# EasyEDA Pro project I2S_XLR_Adapter.eprj, board PCB1
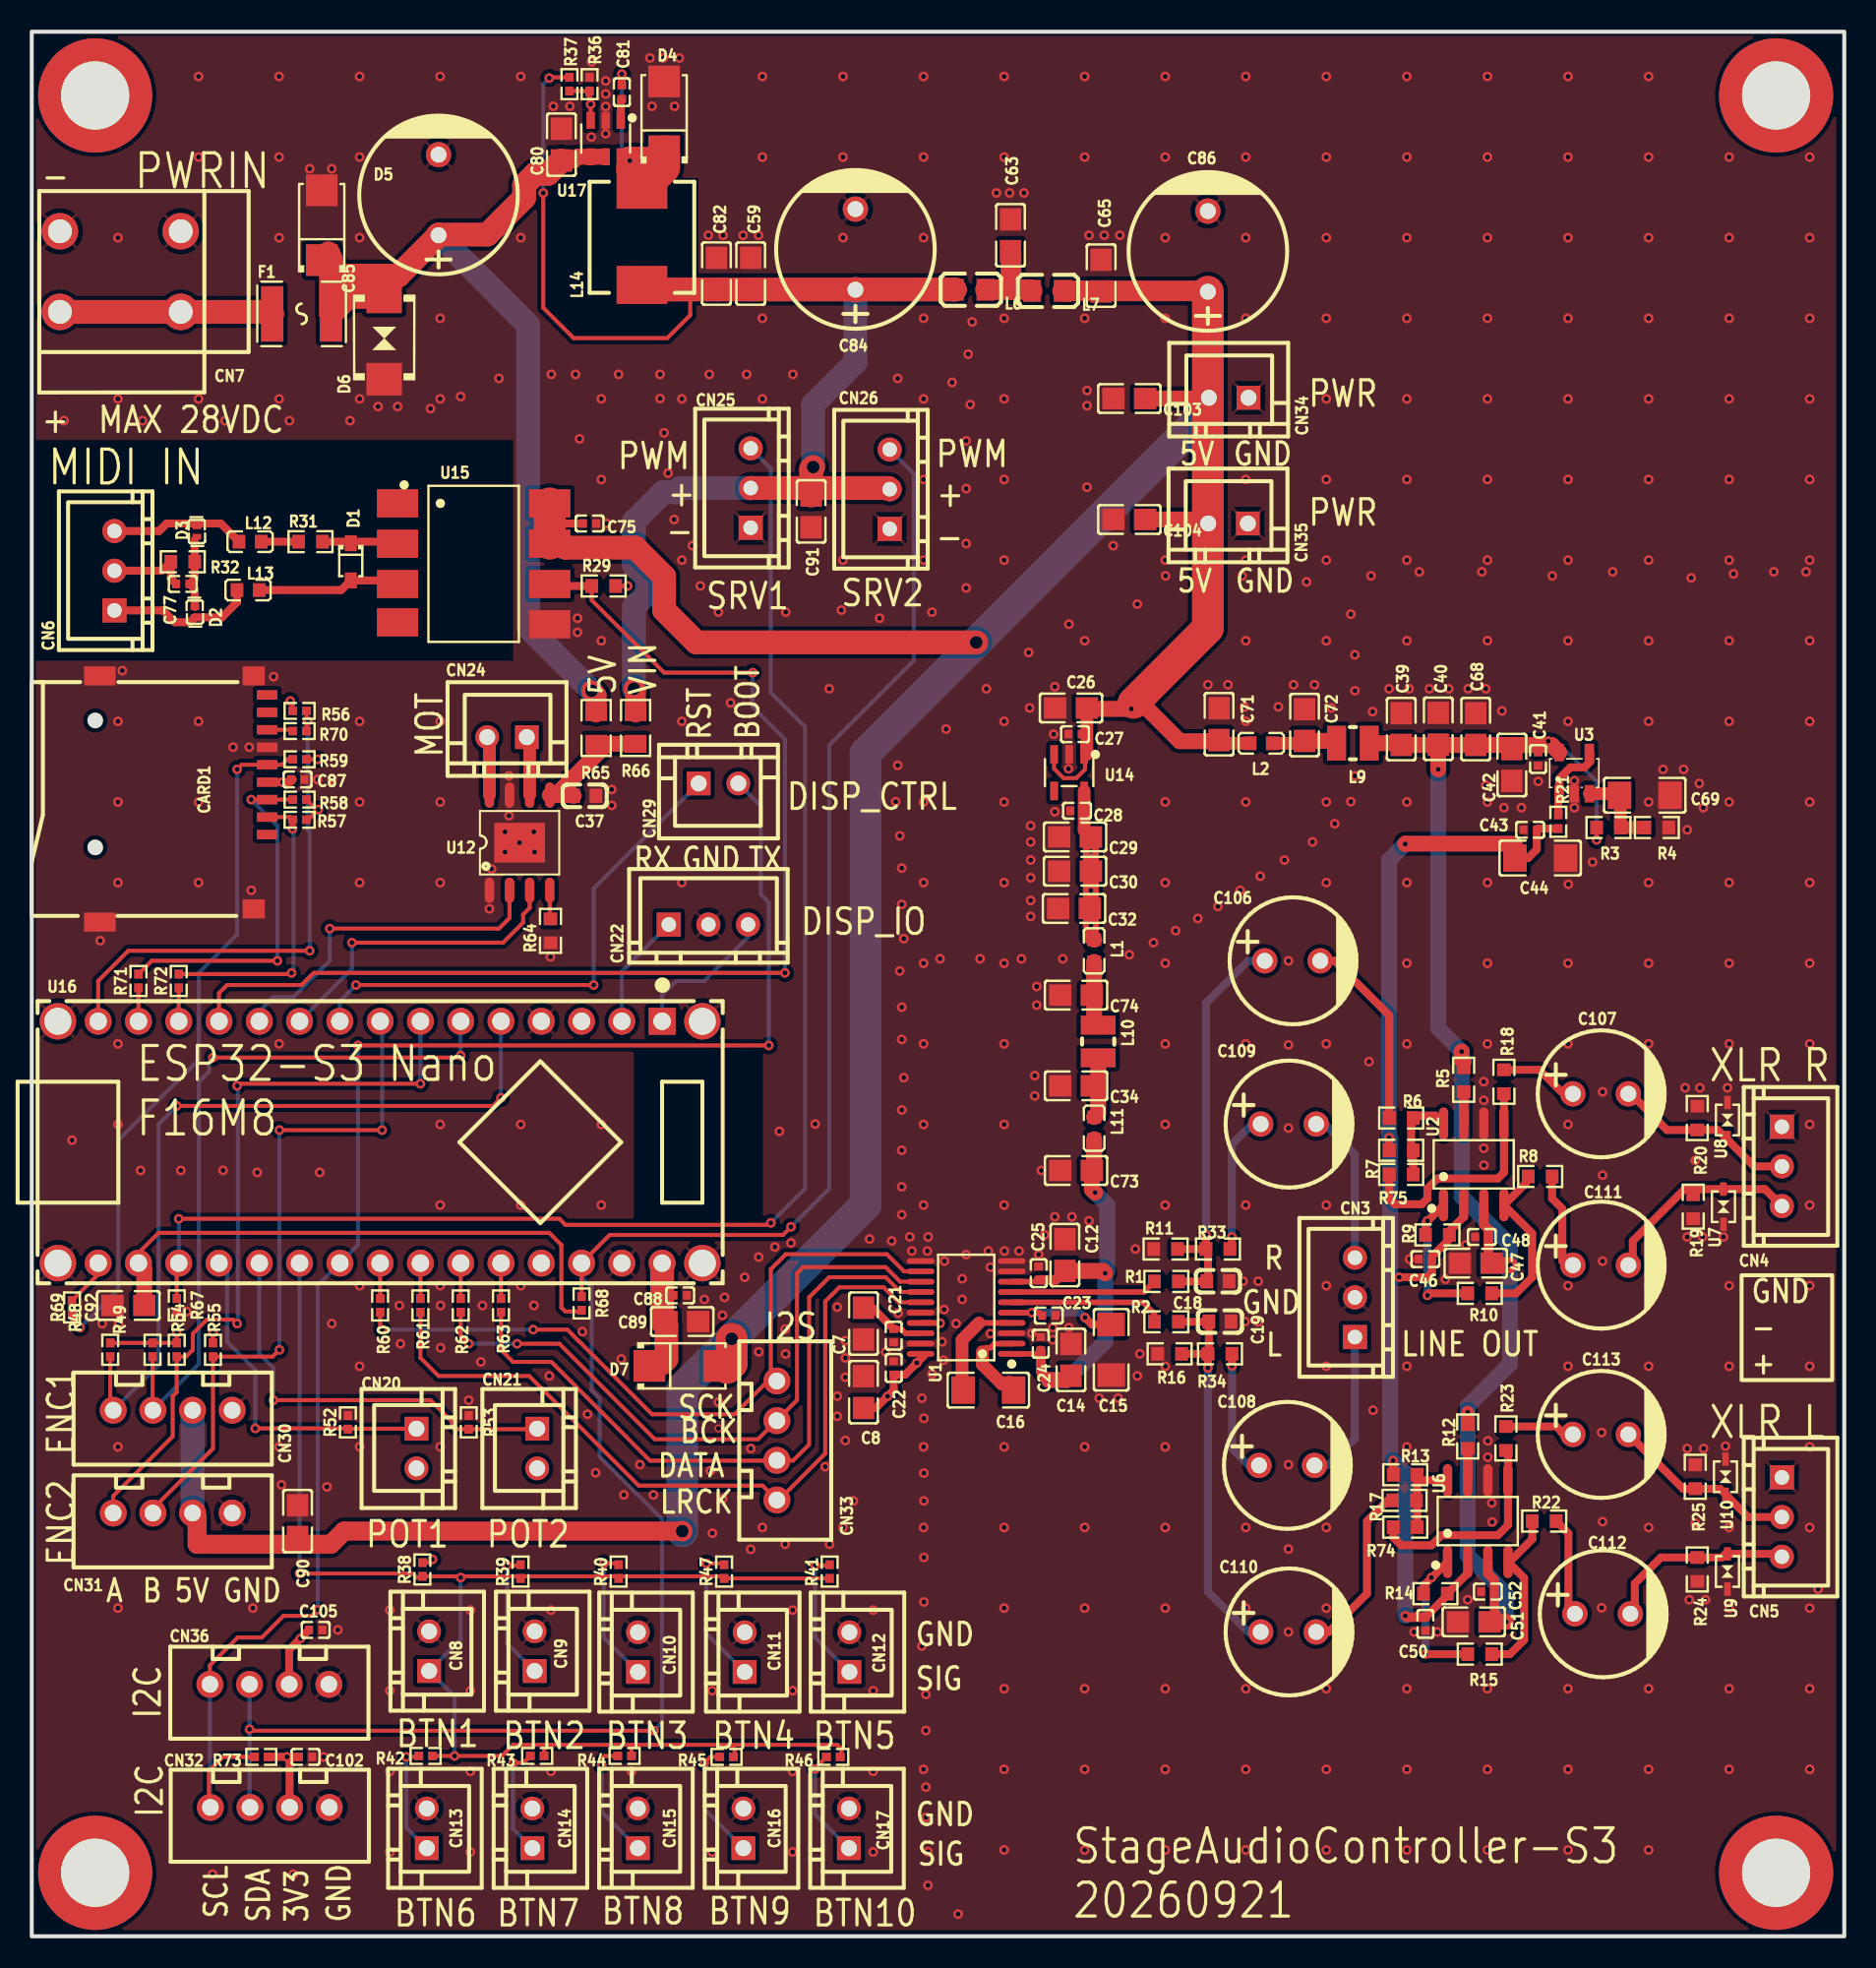
[diagram p4: board, top side]
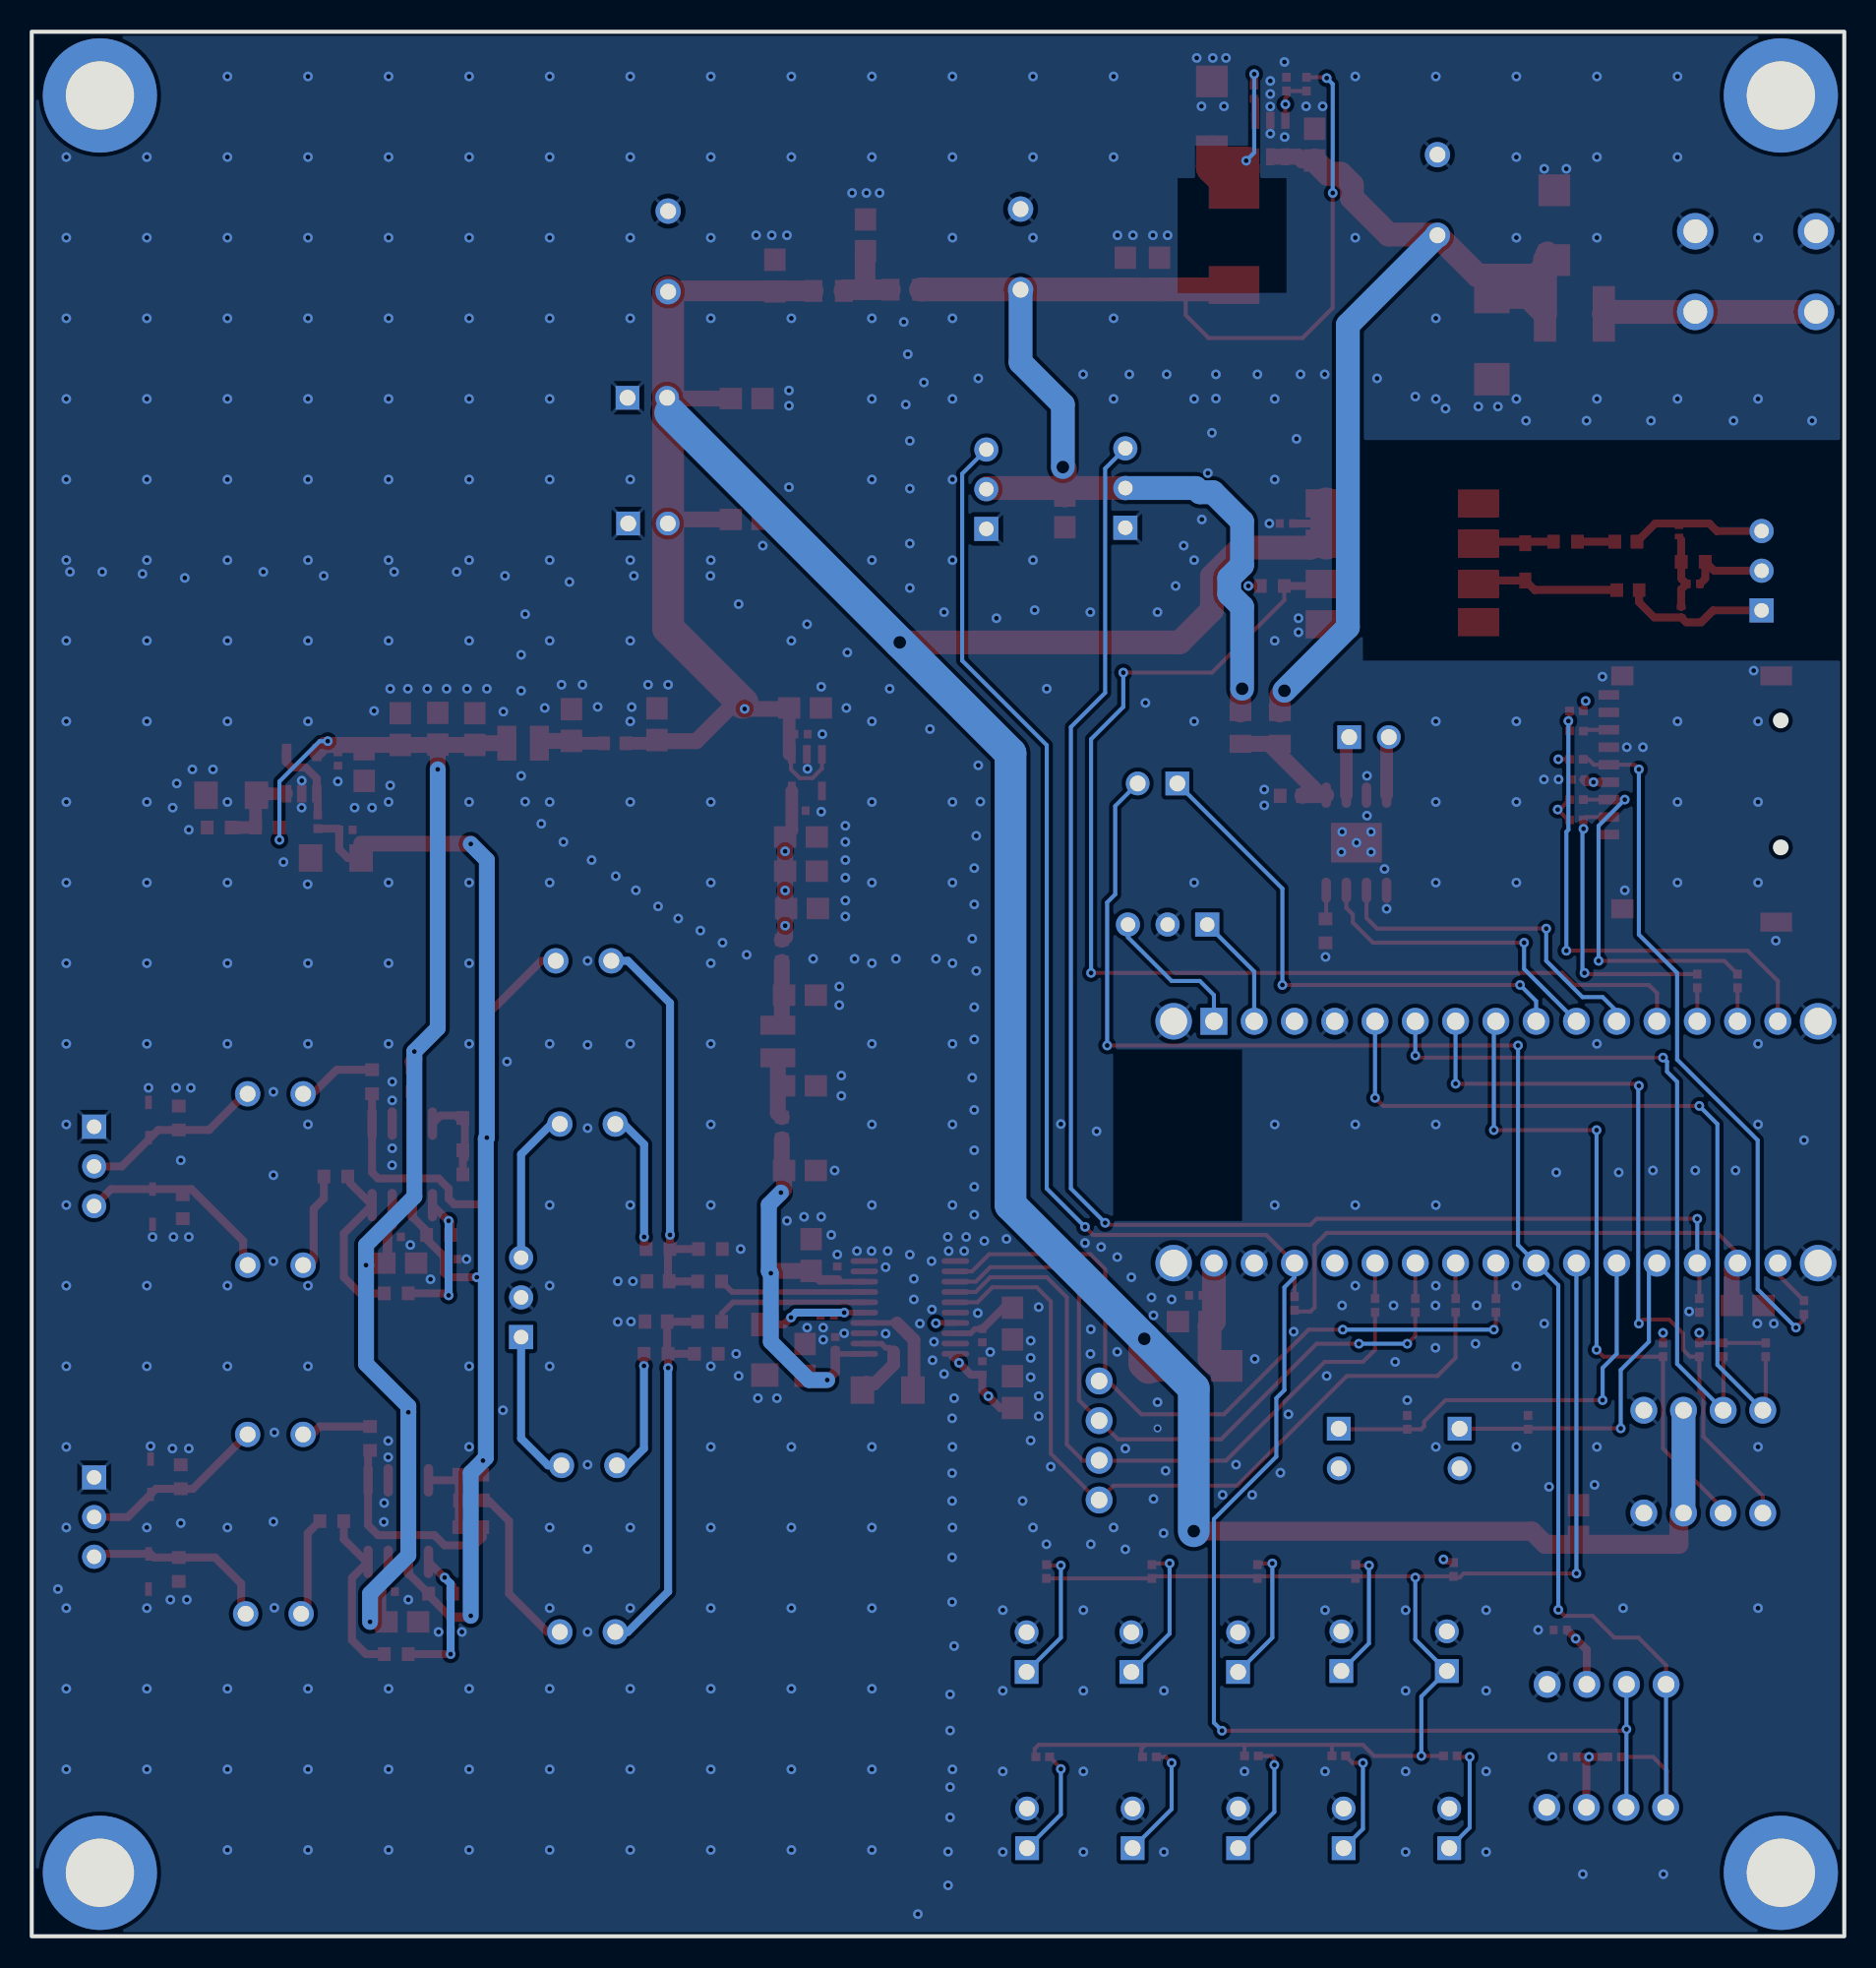
[diagram p5: board, bottom side, seen from below]

Outline 114.3 x 120.02 mm; copper layers: Top Layer, Inner1, Inner2, Bottom Layer. Coordinates in mm from the lower left corner of the outline.
Outline path: rectangle 0,120.02 114.3,0
Stack: Top Layer 0.035mm Outer layer thickness 1oz / Dielectric1 0.2104mm 7628 RC49% 8.6mil / Inner1 0.0152mm Inner layer thickness / Dielectric2 1.065mm 1.1mm H/HOZ Copper / Inner2 0.0152mm Inner layer thickness / Dielectric3 0.2104mm 7628 RC49% 8.6mil / Bottom Layer 0.035mm Outer layer thickness 1oz

## Design rules (mm)
template: Custom Config
spacing copperThickness1oz (default): track to track 0.102, other pairs 0.152 to 0.3
spacing copperThickness2oz: track to track 0.203, other pairs 0.152 to 0.3
track width copperThickness1oz (default): min 0.127, default 0.5, max 2.54
track width copperThickness2oz: min 0.203, default 0.254, max 2.54
differential pair differentialPair (default): width min 0.127, default 0.254, max 2.54; gap min 0.152, default 0.152
via viaSize (default): diameter min 0.5, default 0.61, max 10; hole min 0.3, default 0.305, max 6.3

## Placement (name value [footprint] x y rotation side)
C7  10uF  [C0805]  52.45 38.61 90 top
C8  10uF  [C0805]  52.45 34.29 90 top
C12  10uF  [C0805]  65.15 42.93 270 top
C14  10uF  [C0805]  65.53 36.32 90 top
C15  2.2uF  [C1206]  68.07 36.96 90 top
C16  2.2uF  [C1206]  60.32 34.42 180 top
C18  1nF  [C0603]  74.8 41.28 0 top
C19  1nF  [C0603]  74.93 38.74 180 top
C21  100nF  [C0402]  54.36 37.85 90 top
C22  100nF  [C0402]  54.36 35.81 90 top
C23  100nF  [C0402]  64.13 39.12 180 top
C24  100nF  [C0402]  63.63 37.34 90 top
C25  100nF  [C0402]  63.5 41.78 270 top
C26  10uF  [C0805]  65.54 77.4 180 top
C27  100nF  [C0402]  65.79 75.75 180 top
C28  100nF  [C0402]  65.92 70.93 180 top
C29  10uF  [C0805]  65.79 69.27 180 top
C30  10uF  [C0805]  65.79 67.12 180 top
C32  10uF  [C0805]  65.73 64.77 180 top
C34  10uF  [C0805]  65.85 53.59 180 top
C37  100nF  [C0603]  34.87 71.87 0 top
C39  22uF  [C0805]  86.36 76.07 90 top
C40  22uF  [C0805]  88.7 76.09 90 top
C41  100nF  [C0402]  94.99 74.19 270 top
C42  10uF  [C0805]  93.34 73.81 90 top
C43  100nF  [C0402]  94.49 69.72 0 top
C44  2.2uF  [C1206]  95.12 67.94 180 top
C46  100nF  [C0402]  87.88 42.67 180 top
C47  10uF  [C0805]  91.06 42.42 180 top
C48  100nF  [C0402]  91.44 44.07 0 top
C50  100nF  [C0402]  87.88 19.69 270 top
C51  10uF  [C0805]  90.93 19.81 180 top
C52  100nF  [C0402]  91.82 21.72 0 top
C59  10uF  [C0805]  45.34 104.78 90 top
C63  10uF  [C0805]  61.72 107.19 90 top
C65  10uF  [C0805]  67.44 104.65 90 top
C68  22uF  [C0805]  91.06 76.07 90 top
C69  2.2uF  [C1206]  101.72 71.9 180 top
C71  22uF  [C0805]  74.87 76.38 270 top
C72  22uF  [C0805]  80.26 76.33 270 top
C73  10uF  [C0805]  65.85 48.26 180 top
C74  10uF  [C0805]  65.85 59.31 180 top
C75  100nF  [C0402]  35.18 89.03 0 top
C77  100nF  [C0402]  9.53 85.22 180 top
C80  10uF  [C0805]  33.4 112.9 90 top
C81  10nF  [C0402]  37.21 116.2 270 top
C82  10uF  [C0805]  43.18 104.78 90 top
C84  470uF  [CAP-TH_BD10.0-P5.00-D1.0-FD]  51.94 106.3 90 top
C85  470uF  [CAP-TH_BD10.0-P5.00-D1.0-FD]  25.65 109.73 90 top
C86  470uF  [CAP-TH_BD10.0-P5.00-D1.0-FD]  74.17 106.17 90 top
C87  1uF  [C0402]  16.76 72.9 0 top
C88  1uF  [C0402]  40.89 40.39 180 top
C89  22uF  [C0805]  41.02 38.74 180 top
C90  10uF  [C0805]  16.76 26.16 90 top
C91  10uF  [C0805]  49.15 89.79 270 top
C92  10uF  [C0805]  6.1 39.75 0 top
C102  1uF  [C0402]  17.27 11.3 180 top
C103  10uF  [C0805]  69.22 96.9 180 top
C104  10uF  [C0805]  69.22 89.28 180 top
C105  1uF  [C0402]  17.91 19.3 180 top
C106  10uFBiPol  [CAP-TH_BD8.0-P3.50-D0.6-FD_1]  79.5 61.47 0 top
C107  10uFBiPol  [CAP-TH_BD8.0-P3.50-D0.6-FD_1]  98.93 53.09 0 top
C108  10uFBiPol  [CAP-TH_BD8.0-P3.50-D0.6-FD_1]  79.14 29.67 0 top
C109  10uFBiPol  [CAP-TH_BD8.0-P3.50-D0.6-FD_1]  79.25 51.18 0 top
C110  10uFBiPol  [CAP-TH_BD8.0-P3.50-D0.6-FD_1]  79.25 19.18 0 top
C111  10uFBiPol  [CAP-TH_BD8.0-P3.50-D0.6-FD_1]  98.93 42.29 0 top
C112  10uFBiPol  [CAP-TH_BD8.0-P3.50-D0.6-FD_1]  99.06 20.32 0 top
C113  10uFBiPol  [CAP-TH_BD8.0-P3.50-D0.6-FD_1]  98.93 31.62 0 top
CARD1  TF-01A  [TF-SMD_TF-01A]  9.57 71.67 270 top
CN3  HX-XH2.54-3PZZ  [CONN-TH_3P-P2.50_HC-XH-3A-G]  83.44 40.26 90 top
CN4  HX-XH2.54-3PZZ  [CONN-TH_3P-P2.50_HC-XH-3A-G]  110.36 48.51 270 top
CN5  HX-XH2.54-3PZZ  [CONN-TH_3P-P2.50_HC-XH-3A-G]  110.36 26.42 270 top
CN6  HX-XH2.54-3PZZ  [CONN-TH_3P-P2.50_HC-XH-3A-G]  5.21 86.05 90 top
CN7  DB142V-5.08-2P-GN  [CONN-TH_2P-P5.08_DIBO_DB142V-5.08-2P]  5.59 104.9 90 top
CN8  HX-XH2.54-2PZZ  [CONN-TH_2P-P2.50_HX-2.54MM-2P-ZZ-MS]  25.06 17.97 90 top
CN9  HX-XH2.54-2PZZ  [CONN-TH_2P-P2.50_HX-2.54MM-2P-ZZ-MS]  31.71 17.97 90 top
CN10  HX-XH2.54-2PZZ  [CONN-TH_2P-P2.50_HX-2.54MM-2P-ZZ-MS]  38.23 17.91 90 top
CN11  HX-XH2.54-2PZZ  [CONN-TH_2P-P2.50_HX-2.54MM-2P-ZZ-MS]  44.96 17.91 90 top
CN12  HX-XH2.54-2PZZ  [CONN-TH_2P-P2.50_HX-2.54MM-2P-ZZ-MS]  51.56 17.91 90 top
CN13  HX-XH2.54-2PZZ  [CONN-TH_2P-P2.50_HX-2.54MM-2P-ZZ-MS]  24.92 6.8 90 top
CN14  HX-XH2.54-2PZZ  [CONN-TH_2P-P2.50_HX-2.54MM-2P-ZZ-MS]  31.57 6.8 90 top
CN15  HX-XH2.54-2PZZ  [CONN-TH_2P-P2.50_HX-2.54MM-2P-ZZ-MS]  38.22 6.8 90 top
CN16  HX-XH2.54-2PZZ  [CONN-TH_2P-P2.50_HX-2.54MM-2P-ZZ-MS]  44.88 6.8 90 top
CN17  HX-XH2.54-2PZZ  [CONN-TH_2P-P2.50_HX-2.54MM-2P-ZZ-MS]  51.53 6.8 90 top
CN20  HX-XH2.54-2PZZ  [CONN-TH_2P-P2.50_HX-2.54MM-2P-ZZ-MS]  24.26 30.73 270 top
CN21  HX-XH2.54-2PZZ  [CONN-TH_2P-P2.50_HX-2.54MM-2P-ZZ-MS]  31.88 30.73 270 top
CN22  HX-XH2.54-3PZZ  [CONN-TH_3P-P2.50_HC-XH-3A-G]  42.67 63.75 0 top
CN24  HX-XH2.54-2PZZ  [CONN-TH_2P-P2.50_HX-2.54MM-2P-ZZ-MS]  29.97 75.56 180 top
CN25  HX-XH2.54-3PZZ  [CONN-TH_3P-P2.50_HC-XH-3A-G]  45.34 91.26 90 top
CN26  HX-XH2.54-3PZZ  [CONN-TH_3P-P2.50_HC-XH-3A-G]  54.1 91.19 90 top
CN29  HX-XH2.54-2PZZ  [CONN-TH_2P-P2.50_HX-2.54MM-2P-ZZ-MS]  43.31 72.64 0 top
CN30  HX-XH2.54-4PZZ  [CONN-TH_4P-P2.50-XH2.54-4P]  8.89 33.15 0 top
CN31  HX-XH2.54-4PZZ  [CONN-TH_4P-P2.50-XH2.54-4P]  8.89 26.67 0 top
CN32  HX-XH2.54-4PZZ  [CONN-TH_4P-P2.50-XH2.54-4P]  15.01 8.12 0 top
CN33  HX-XH2.54-4PZZ  [CONN-TH_4P-P2.50-XH2.54-4P]  46.99 31.24 90 top
CN34  HX-XH2.54-2PZZ  [CONN-TH_2P-P2.50_HX-2.54MM-2P-ZZ-MS]  75.48 96.95 180 top
CN35  HX-XH2.54-2PZZ  [CONN-TH_2P-P2.50_HX-2.54MM-2P-ZZ-MS]  75.44 89.03 180 top
CN36  HX-XH2.54-4PZZ  [CONN-TH_4P-P2.50-XH2.54-4P]  14.99 15.88 0 top
D1  1N4148WS  [SOD-323_L1.8-W1.3-LS2.5-RD]  20.12 86.61 270 top
D2  RCLAMP0521P-N  [X1-DFN1006-2_L1.0-W0.6-P0.65-BI]  10.29 83.44 270 top
D3  RCLAMP0521P-N  [X1-DFN1006-2_L1.0-W0.6-P0.65-BI]  10.41 88.52 90 top
D4  SS34  [SMA_L4.3-W2.6-LS5.2-RD]  39.88 114.68 90 top
D5  SS34  [SMA_L4.3-W2.6-LS5.2-RD]  18.29 107.82 90 top
D6  SMBJ30CA-AT/TR13  [SMB_L4.3-W3.6-LS5.4-BI]  22.22 100.71 90 top
D7  SS34  [SMA_L4.3-W2.6-LS5.2-RD]  41.15 35.94 0 top
F1  1812L150/33GR  [F1812]  17.02 102.23 0 top
L1  BLM18PG121SN1D  [L0603]  67 62.1 270 top
L2  BLM18PG121SN1D  [L0603]  77.53 75.18 0 top
L6  BLM21PG221SN1D  [L0805]  59.18 103.76 180 top
L7  BLM21PG221SN1D  [L0805]  64.05 103.68 180 top
L9  10uH  [IND-SMD_L2.5-W2.0]  83.31 75.18 0 top
L10  10uH  [IND-SMD_L2.5-W2.0]  67.25 56.38 270 top
L11  BLM18PG121SN1D  [L0603]  67 50.92 270 top
L12  BLM18PG121SN1D  [L0603]  13.77 87.88 0 top
L13  BLM18PG121SN1D  [L0603]  13.64 84.83 0 top
L14  6.8uH  [IND-SMD_L7.0-W6.6]  38.48 107.06 270 top
NOREF  -  [Pad_e261]  110 4 0 top
NOREF#2  -  [Pad_e260]  4 4 0 top
NOREF#3  -  [Pad_e259]  4 116 0 top
NOREF#4  -  [Pad_e257]  110 116 0 top
R1  150Ω  [R0603]  71.55 41.26 0 top
R2  150Ω  [R0603]  71.55 38.72 0 top
R3  10kΩ  [R0603]  99.43 69.87 180 top
R4  10kΩ  [R0603]  102.48 69.87 180 top
R5  10kΩ  [R0603]  90.3 53.97 90 top
R6  1kΩ  [R0603]  86.36 51.56 180 top
R7  2kΩ  [R0603]  86.36 49.53 180 top
R8  150Ω  [R0603]  95.12 47.88 0 top
R9  2kΩ  [R0603]  88.65 44.2 180 top
R10  2kΩ  [R0603]  91.31 40.51 0 top
R11  100kΩ  [R0603]  71.5 43.31 180 top
R12  10kΩ  [R0603]  90.55 31.5 90 top
R13  2kΩ  [R0603]  86.61 29.08 180 top
R14  2kΩ  [R0603]  88.52 21.59 180 top
R15  2kΩ  [R0603]  91.31 17.78 0 top
R16  100kΩ  [R0603]  71.75 36.7 180 top
R17  1kΩ  [R0603]  86.57 27.47 180 top
R18  150Ω  [R0603]  92.84 53.85 90 top
R19  100kΩ  [R0603]  104.78 45.97 270 top
R20  100kΩ  [R0603]  105.03 51.56 270 top
R21  100Ω  [R0402]  96.27 70.23 270 top
R22  150Ω  [R0603]  95.38 26.16 0 top
R23  150Ω  [R0603]  92.96 31.37 90 top
R24  100kΩ  [R0603]  105.03 23.11 270 top
R25  100kΩ  [R0603]  104.9 28.96 270 top
R29  4.7kΩ  [R0603]  36.07 85.09 0 top
R31  220Ω  [R0603]  17.58 87.88 0 top
R32  1MΩ  [R0603]  9.53 86.61 180 top
R33  470Ω  [R0603]  74.8 43.31 0 top
R34  470Ω  [R0603]  74.93 36.7 0 top
R36  10kΩ  [R0402]  35.18 116.71 270 top
R37  56kΩ  [R0402]  33.91 116.71 90 top
R38  10kΩ  [R0402]  24.64 23.11 90 top
R39  680Ω  [R0402]  30.83 22.98 90 top
R40  1.5kΩ  [R0402]  37.01 22.98 90 top
R41  3.9kΩ  [R0402]  50.32 22.98 90 top
R42  5.6kΩ  [R0402]  24.84 11.36 180 top
R43  8.2kΩ  [R0402]  31.88 11.36 180 top
R44  12kΩ  [R0402]  37.39 11.36 180 top
R45  18kΩ  [R0402]  43.81 11.3 180 top
R46  33kΩ  [R0402]  50.55 11.3 180 top
R47  2.4kΩ  [R0402]  43.66 22.98 90 top
R48  10kΩ  [R0402]  4.95 36.96 270 top
R49  10kΩ  [R0402]  7.62 36.96 270 top
R52  1.5kΩ  [R0402]  19.94 32.38 90 top
R53  1.5kΩ  [R0402]  27.56 32.38 90 top
R54  10kΩ  [R0402]  9.14 36.96 270 top
R55  10kΩ  [R0402]  11.43 36.96 270 top
R56  10kΩ  [R0402]  16.89 77.22 0 top
R57  10kΩ  [R0402]  16.89 70.36 180 top
R58  10kΩ  [R0402]  16.89 71.63 180 top
R59  10kΩ  [R0402]  16.89 74.17 180 top
R60  22Ω  [R0402]  21.97 39.75 90 top
R61  22Ω  [R0402]  24.51 39.75 90 top
R62  22Ω  [R0402]  27.05 39.75 90 top
R63  22Ω  [R0402]  29.59 39.75 90 top
R64  30kΩ  [R0603]  32.71 63.36 90 top
R65  0Ω  [R0805]  35.59 76.14 90 top
R66  0Ω  [R0805]  38.08 76.14 90 top
R67  10kΩ  [R0402]  9.14 39.75 270 top
R68  10kΩ  [R0402]  34.67 39.88 270 top
R69  22Ω  [R0402]  2.54 39.62 90 top
R70  22Ω  [R0402]  16.89 75.95 180 top
R71  22Ω  [R0402]  6.73 60.2 90 top
R72  22Ω  [R0402]  9.27 60.2 90 top
R73  10kΩ  [R0402]  14.48 11.3 180 top
R74  2kΩ  [R0603]  86.61 25.78 0 top
R75  2kΩ  [R0603]  86.36 48.01 180 top
U1  PCM5102APWR  [TSSOP-20_L6.5-W4.4-P0.65-LS6.4-BL]  58.93 39.62 90 top
U2  OPA1632DR  [SOIC-8_L4.9-W3.9-P1.27-LS6.0-BL]  90.93 48.64 0 top
U3  OPA333AIDBVR  [SOT-23-5_L3.0-W1.7-P0.95-LS2.8-BR]  97.27 73.3 270 top
U6  OPA1632DR  [SOIC-8_L4.9-W3.9-P1.27-LS6.0-BL]  91.19 26.16 0 top
U7  H12VSD3B  [SOD-323_L1.8-W1.3-LS2.7-BI]  106.68 45.97 270 top
U8  H12VSD3B  [SOD-323_L1.8-W1.3-LS2.7-BI]  106.93 51.44 270 top
U9  H12VSD3B  [SOD-323_L1.8-W1.3-LS2.7-BI]  106.93 22.99 270 top
U10  H12VSD3B  [SOD-323_L1.8-W1.3-LS2.7-BI]  106.81 28.96 270 top
U12  DRV8871DDAR  [SO-8_L4.9-W3.9-P1.27-LS6.0-BL-EP]  30.77 68.91 0 top
U14  XTPS7A2033-XC  [SOT-23-5_L3.0-W1.7-P0.95-LS2.8-BL]  65.42 73.33 180 top
U15  6N137S1(TA)  [SMD-8_L9.8-W6.6-P2.54-LS10.3-BL]  27.87 86.48 270 top
U16  ESP32-S3-NANO  [COMM-TH_43.2-W17.8-P2.54_ESP32-S3]  21.97 50.04 0 top
U17  EUP3458VIR1  [SOT-23-6_L2.9-W1.6-P0.95-LS2.8-BL]  36.19 113.28 180 top

## Footprints (pads in the part's own frame, mm; a bottom-side part is the same pattern mirrored in y, then rotated)
C0402
  rect 0.5x0.54 smd: 1(-0.42,0) 2(0.42,0)
C0603
  rect 0.8x0.9 smd: 1(-0.7,0) 2(0.7,0)
C0805
  rect 1.41x1.35 smd: 1(-1,0) 2(1,0)
C1206
  rect 1.485x1.728 smd: 1(-1.593,0) 2(1.593,0)
CAP-TH_BD8.0-P3.50-D0.6-FD_1
  round 1.6 hole 1: 1(-1.75,0) 2(1.75,0)
CAP-TH_BD10.0-P5.00-D1.0-FD
  round 1.6 hole 1: 1(-2.54,0) 2(2.54,0)
COMM-TH_43.2-W17.8-P2.54_ESP32-S3
  rect 1.7x1.7 hole 1.1: 1(17.78,7.62)
  round 1.7 hole 1.1: 2(15.24,7.62) 3(12.7,7.62) 4(10.16,7.62) 5(7.62,7.62) 6(5.08,7.62) 7(2.54,7.62) 8(0,7.62) 9(-2.54,7.62) 10(-5.08,7.62) 11(-7.62,7.62) 12(-10.16,7.62) 13(-12.7,7.62) 14(-15.24,7.62) 15(-17.78,7.62) 16(-17.78,-7.62) 17(-15.24,-7.62) 18(-12.7,-7.62) 19(-10.16,-7.62) 20(-7.62,-7.62) 21(-5.08,-7.62) 22(-2.54,-7.62) 23(0,-7.62) 24(2.54,-7.62) 25(5.08,-7.62) 26(7.62,-7.62) 27(10.16,-7.62) 28(12.7,-7.62) 29(15.24,-7.62) 30(17.78,-7.62)
  round 2.3 hole 1.7: 31(20.32,7.62) 32(20.32,-7.62) 33(-20.32,-7.62) 34(-20.32,7.62)
CONN-TH_2P-P2.50_HX-2.54MM-2P-ZZ-MS
  rect 1.5x1.5 hole 1: 1(-1.25,0)
  round 1.5 hole 1: 2(1.25,0)
CONN-TH_2P-P5.08_DIBO_DB142V-5.08-2P
  round 2.3 hole 1.5: 1(-2.54,3.81) 1(-2.54,-3.81) 2(2.54,3.81) 2(2.54,-3.81)
CONN-TH_3P-P2.50_HC-XH-3A-G
  rect 1.524x1.524 hole 0.914: 1(-2.5,0)
  round 1.524 hole 0.914: 2(0,0) 3(2.5,0)
CONN-TH_4P-P2.50-XH2.54-4P
  round 1.7 hole 1.05: 1(3.75,0) 2(1.25,0) 3(-1.25,0) 4(-3.75,0)
F1812
  rect 1.407x3.499 smd: 1(-1.853,0) 2(1.853,0)
IND-SMD_L2.5-W2.0
  rect 1.2x2.2 smd: 1(1.028,0) 2(-1.028,0)
IND-SMD_L7.0-W6.6
  rect 2.4x3.2 smd: 1(-3,0) 2(3,0)
L0603
  rect 0.8x0.864 smd: 1(-0.7,0) 2(0.7,0)
L0805
  rect 1.133x1.377 smd: 1(-0.966,0) 2(0.966,0)
Pad_e257
  round 7.2 hole 4.3: (0,0)
Pad_e259
  round 7.2 hole 4.3: (0,0)
Pad_e260
  round 7.2 hole 4.3: (0,0)
Pad_e261
  round 7.2 hole 4.3: (0,0)
R0402
  rect 0.566x0.54 smd: 1(-0.433,0) 2(0.433,0)
R0603
  rect 0.806x0.864 smd: 1(-0.753,0) 2(0.753,0)
R0805
  rect 1.133x1.377 smd: 1(-1,0) 2(1,0)
SMA_L4.3-W2.6-LS5.2-RD
  rect 2x2 smd: 1(-2.2,0) 2(2.2,0)
SMB_L4.3-W3.6-LS5.4-BI
  rect 2.047x2.241 smd: 1(-2.591,0) 2(2.591,0)
SMD-8_L9.8-W6.6-P2.54-LS10.3-BL
  rect 1.78x2.6 smd: 1(-3.81,-4.8) 2(-1.27,-4.8) 3(1.27,-4.8) 4(3.683,-4.8) 5(3.81,4.8) 6(1.27,4.8) 7(-1.27,4.8) 8(-3.81,4.8)
SO-8_L4.9-W3.9-P1.27-LS6.0-BL-EP
  oval 0.6x1.6 smd: 1(-1.905,-3) 2(-0.635,-3) 3(0.635,-3) 4(1.905,-3) 5(1.905,3) 6(0.635,3) 7(-0.635,3) 8(-1.905,3)
  rect 3.2x2.5 smd: 9(0,0)
SOD-323_L1.8-W1.3-LS2.5-RD
  rect 1x0.75 smd: 1(-1.173,0) 2(1.173,0)
SOD-323_L1.8-W1.3-LS2.7-BI
  rect 0.845x0.42 smd: 1(-1.11,0) 2(1.11,0)
SOIC-8_L4.9-W3.9-P1.27-LS6.0-BL
  oval 0.588x2.045 smd: 1(-1.905,-2.57) 2(-0.635,-2.57) 3(0.635,-2.57) 4(1.905,-2.57) 5(1.905,2.57) 6(0.635,2.57) 7(-0.635,2.57) 8(-1.905,2.57)
SOT-23-5_L3.0-W1.7-P0.95-LS2.8-BL
  rect 0.49x1.157 smd: 1(-0.95,-1.153) 2(0,-1.153) 3(0.95,-1.153)
  rect 0.49x1.175 smd: 4(0.95,1.153) 5(-0.95,1.153)
SOT-23-5_L3.0-W1.7-P0.95-LS2.8-BR
  rect 1.1x0.6 smd: 1(1.3,-0.95) 2(1.3,0) 3(1.3,0.95) 4(-1.3,0.95) 5(-1.3,-0.95)
SOT-23-6_L2.9-W1.6-P0.95-LS2.8-BL
  rect 0.532x1.072 smd: 1(-0.95,-1.149) 2(0,-1.149) 3(0.95,-1.149) 4(0.95,1.149) 5(0,1.149) 6(-0.95,1.149)
TF-SMD_TF-01A
  rect 0.6x1.3 smd: 1(2.24,5.276) 2(1.14,5.276) 3(0.04,5.276) 4(-1.06,5.276) 5(-2.16,5.276) 6(-3.26,5.276) 7(-4.36,5.276) 8(-5.46,5.276) 9(-6.56,5.276)
  rect 1.2x1.4 smd: 10(-7.76,4.426) 13(6.92,4.426)
  rect 1.2x2 smd: 11(-7.76,-5.276) 12(7.76,-5.276)
TSSOP-20_L6.5-W4.4-P0.65-LS6.4-BL
  oval 0.364x1.742 smd: 1(-2.925,-2.871) 2(-2.275,-2.871) 3(-1.625,-2.871) 4(-0.975,-2.871) 5(-0.325,-2.871) 6(0.325,-2.871) 7(0.975,-2.871) 8(1.625,-2.871) 9(2.275,-2.871) 10(2.925,-2.871) 11(2.925,2.871) 12(2.275,2.871) 13(1.625,2.871) 14(0.975,2.871) 15(0.325,2.871) 16(-0.325,2.871) 17(-0.975,2.871) 18(-1.625,2.871) 19(-2.275,2.871) 20(-2.925,2.871)
X1-DFN1006-2_L1.0-W0.6-P0.65-BI
  rect 0.35x0.55 smd: 1(-0.325,0) 2(0.325,0)

## Nets
As in the schematic.

Pads without a net: CARD1 1 8 9; U14 4; U15 1 4; U16 3 27

## Via types
v1: diameter 0.61, hole 0.305, Top Layer to Bottom Layer, 732 vias
v2: diameter 0.5, hole 0.305, Top Layer to Bottom Layer, 1 via
v3: diameter 1.3, hole 0.8, Top Layer to Bottom Layer, 6 vias

## Routing (per net, layer and track width the routed paths; a pad name or vN(x,y) marks a point on that pad's centre or on a via; arc(x,y) is an arc through that point)
2V5A: length 75.5
  Top Layer w0.5: v1(86.23,41.53) 88.01,41.53 88.3,41.82 C46.1 88.3,42.84 89.4,43.93 R9.1 89.4,44.44 90.3,45.34 U2.2 ; R7.2 85.6,49.52 v1(85.6,50.32) ; v1(85.84,29.97) 85.86,29.96 R13.2 ; R21.2 94.98,69.8 C43.2 94.91,68.49 94.36,67.94 C44.2 ; C50.1 89.27,21.49 R14.1 90.55,22.87 U6.2
  Top Layer w0.6: v1(86.61,20.19) 86.7,20.1 C50.1
  Top Layer w1: v1(86.61,68.83) 86.63,68.85 93.52,68.85
  Bottom Layer w1: v1(86.61,68.83) 85.6,67.82 v1(85.6,50.32) 85.66,50.26 85.66,30.15 v1(85.84,29.97) 86.61,29.2 v1(86.61,20.19)
3V3: length 37.8
  Top Layer w0.254: R48.1 R49.1 R54.1 v1(9.14,38.03) ; R59.1 v1(18.03,74.17) ; R56.1 16.46,77.69 v1(16.31,77.84) ; R57.1 17.43,70.36 v1(18.07,71) 17.95,71 R58.1 ; R29.2 v1(37.58,85.09) ; v1(25.27,23.75) 25.07,23.55 R38.2 ; v1(11.43,38.02) R55.1
  Top Layer w0.35: U1.17 57.26,38.65 v1(57.28,38.63)
  Top Layer w0.5: 56.26,36.58 v1(55.82,36.13) 55.08,35.39 C22.1 54.36,34.42 v1(53.97,34.03) 53.23,33.29 C8.1 ; CN36.2 16.24,18.05 v1(16.94,18.75) C105.2 ; v1(16.1,11.3) 16.26,11.14 CN32.2 ; v1(16.1,11.3) C102.2 ; v1(16.1,11.3) R73.1 ; 16.47,72.9 16.3,72.73 v1(15.82,72.73) CARD1.4
  Top Layer w0.8: C29.1 66.37,69.69 U14.5
  Top Layer w1: C29.1 v1(66.79,68.37) C30.1 v1(66.79,65.9) v1(66.79,63.68) 66.79,63.01 L1.1
3V3A: length 29.6
  Top Layer w0.35: U1.8 63.39,41.25 C25.2 ; C24.1 63.41,36.7 61.8,36.7
  Top Layer w0.6: C25.2 64.59,41.36 C12.2 ; v1(64.13,35.05) 63.63,35.56 C24.1
  Top Layer w1: C14.1 65.26,35.05 v1(64.13,35.05) ; C12.2 67.55,41.93 v1(67.69,41.78) ; L11.2 67,48.4 C73.1 66.85,47.07 v1(67.06,46.86)
  Bottom Layer w1: v1(64.13,35.05) 65.28,35.05 67.69,37.47 v1(67.69,41.78) 67.82,41.91 67.82,46.1 v1(67.06,46.86)
3V3ESP: length 36
  Top Layer w0.254: 34.36,39.37 33.66,39.37 33.4,39.62 33.4,43.56 32.64,44.32 8,44.32 6.73,43.05 U16.17
  Top Layer w1: U16.17 7.1,42.05 C92.2
5V: length 223
  Top Layer w0.254: 66.42,74.3 66.42,73.53 65.87,72.98 65.07,72.98 64.47,73.58 U14.3 ; 66.42,74.43 U14.1
  Top Layer w0.5: 33.02,88.9 33.14,89.02 34.76,89.02
  Top Layer w0.8: C26.1 66.54,74.48 ; L2.1 75.08,75.18 C71.2
  Top Layer w1: v1(69.34,77.34) 66.6,77.34 C26.1 ; C103.1 74.18,96.9 CN34.2 ; C104.1 74.23,89.28 ; C71.2 74.8,75.31 72.39,75.31 70.36,77.34
  Top Layer w1.2: CN31.2 10.43,26.38 10.43,24.7 18.86,24.7 19.69,25.53 v3(41.02,25.53)
  Top Layer w1.3: L7.1 74.12,103.68
  Top Layer w1.5: U15.7 33.4,87.75 33.66,87.5 38.06,87.5 39.88,85.69 39.88,83.57 41.91,81.53 v3(59.56,81.53)
  Top Layer w2: v3(44.14,37.65) 44.14,36.1 43.86,35.81 ; 69.47,77.72 74.17,82.42 C86.1 ; U15.8 U15.7
  Bottom Layer w1.5: CN30.2 CN31.2
  Bottom Layer w2: v3(41.02,25.53) 41.02,34.53 v3(44.14,37.65) 52.58,46.09 52.58,74.55 v3(59.56,81.53) 74.04,96.01
5V_P: length 91.7
  Top Layer w0.254: v1(32.26,109.85) 32.26,102.62 34.16,100.71 40.08,100.71 41.53,102.16 41.53,103.5 ; R37.2 32.69,117.15 v1(32.64,117.09)
  Top Layer w1.3: R66.2 38.08,78.51 v3(37.97,78.61)
  Top Layer w1.5: CN26.2 54.03,91.26 49.15,91.26 ; v3(49.28,92.58) 49.15,92.46 49.15,91.26 ; L14.2 38.77,103.78 C82.1 C59.1 58.2,103.78 L6.2 ; 49.15,91.26 C91.1 ; 49.15,91.26 CN25.2
  Bottom Layer w0.254: v1(32.26,109.85) 32.26,116.71 v1(32.64,117.09)
  Bottom Layer w1.5: v3(49.28,92.58) 49.28,96.52 51.94,99.19 C84.1 ; CN25.2 40.9,91.26 40.63,91 39.81,91 37.97,89.15 37.97,86.4 38.79,85.59 38.79,84.59 37.97,83.78 v3(37.97,78.61)
5VA: length 92
  Top Layer w0.254: R3.2 v1(98.68,69.09) ; v1(95.63,75.31) 95.56,75.24 95.56,75.07
  Top Layer w0.6: U6.3 91.82,22.86 92.24,22.44 C52.2 92.24,20.12 C51.1 ; C47.1 91.86,42.62 C48.2 91.86,44.54 91.57,44.83 91.57,46.07
  Top Layer w0.8: R12.2 v1(90.55,33.02)
  Top Layer w1: v1(92.96,19.81) C51.1 ; v1(90.17,55.75) 90.17,55.25 90.3,55.12 ; C40.1 88.7,75.07 ; 88.7,75.07 C68.1 95.85,75.07 U3.5 ; 88.7,75.07 C39.1 86.25,75.18 L9.1 ; 88.7,75.07 v1(88.7,73.53) ; v1(93.22,42.29) 92.19,42.29 C47.1
  Bottom Layer w0.254: v1(95.63,75.31) 96.14,75.31 98.68,72.77 v1(98.68,69.09)
  Bottom Layer w1: v1(92.96,19.81) 92.96,21.59 90.55,24 v1(90.55,33.02) 90.55,33.4 93.22,36.07 v1(93.22,42.29) 93.22,43.56 90.17,46.61 v1(90.17,55.75) 88.7,57.23 v1(88.7,73.53)
GND:
  vias: v1(2.03,95.5) v1(2.54,50.17) v1(4.32,62.74) v1(4.44,38.61) v1(5.44,107.04) v1(5.44,96.88) v1(5.44,76.56) v1(5.44,71.48) v1(5.44,66.4) v1(5.44,56.24) v1(5.44,51.16) v1(5.44,30.84) v1(5.44,20.68) v1(5.48,38.61) v1(5.72,79.76) v1(6.86,48.26) v1(6.98,95.5) v1(9.4,48.26) v1(9.78,39.37) v1(10.52,117.2) v1(10.52,112.12) v1(10.52,96.88) v1(10.52,76.56) v1(10.52,71.48) v1(10.52,66.4) v1(11.41,3.91) v1(12.06,48.26) v1(12.19,95.5) v1(12.7,74.93) v1(13.72,74.93) v1(13.84,65.91) v1(13.95,20.68) v1(14.22,48.13) v1(15.25,79.38) v1(15.6,117.2) v1(15.6,112.12) v1(15.6,107.04) v1(15.6,96.88) v1(15.6,56.24) v1(15.6,30.84) v1(15.75,28.45) v1(16.26,95.5) v1(16.49,3.91) v1(17.53,111.38) v1(18.02,72.9) v1(18.16,48.13) v1(18.4,11.3) v1(18.62,28.32) v1(18.92,111.38) v1(18.94,72.9) v1(18.92,38.61) v1(19.3,19.3) v1(20.07,95.5) v1(20.68,117.2) v1(20.68,112.12) v1(20.68,107.04) v1(20.68,96.88) v1(20.68,76.56) v1(20.68,71.48) v1(20.68,66.4) v1(20.68,41) v1(20.68,35.92) v1(20.68,30.84) v1(21.84,96.39) v1(22.58,20.55) v1(22.58,15.47) v1(22.58,10.39) v1(22.58,5.31) v1(23.08,96.39) v1(23.18,39.75) v1(23.26,37.34) v1(25.15,96.27) v1(25.76,117.2) v1(25.76,101.96) v1(25.76,96.88) v1(25.76,76.56) v1(25.76,71.48) v1(25.76,66.4) v1(25.76,51.16) v1(25.76,46.08) v1(25.76,41) v1(25.78,39.75) v1(25.78,37.08) v1(25.76,30.84) v1(27.05,97.03) v1(27.56,33.78) v1(27.66,20.55) v1(27.66,15.47) v1(27.66,10.39) v1(27.66,5.31) v1(28.32,36.19) v1(28.42,39.75) v1(28.86,64.75) v1(28.99,67.25) v1(29.46,98.17) v1(29.84,69.6) v1(29.84,68.33) v1(30.1,73.12) v1(30.1,70.61) v1(30.84,117.2) v1(30.84,107.04) v1(30.76,68.91) v1(30.84,51.16) v1(30.84,46.08) v1(30.84,41) v1(31.66,69.6) v1(31.71,68.33) v1(31.67,39.75) v1(32.64,35.31) v1(32.71,61.71) v1(32.74,20.55) v1(32.74,10.39) v1(32.77,98.42) v1(32.89,115.32) v1(33.94,115.32) v1(34.29,98.42) v1(34.42,83.06) v1(34.42,82.17) v1(34.54,94.36) v1(34.72,38.1) v1(35.05,32.89) v1(35.31,118.11) v1(35.29,113.38) v1(35.56,29.21) v1(35.92,96.88) v1(35.92,91.8) v1(35.92,81.64) v1(35.92,51.16) v1(35.92,46.08) v1(36.19,116.91) v1(36.19,116.09) v1(36.19,115.3) v1(36.19,113.59) v1(36.26,89.03) v1(36.58,72.26) v1(36.58,71.26) v1(37.01,98.42) v1(37.18,36.38) v1(37.34,27.81) v1(37.82,10.39) v1(38.35,29.72) v1(38.99,118.36) v1(39.12,115.32) v1(39.2,27.81) v1(39.62,98.42) v1(39.62,96.9) v1(39.82,118.36) v1(39.88,94.74) v1(40.13,92.2) v1(40.54,115.32) v1(40.51,89.28) v1(40.84,118.36) v1(41,96.88) v1(41,86.72) v1(41,76.56) v1(41,66.4) v1(41.66,87.63) v1(42.16,85.09) v1(42.42,40.13) v1(42.67,107.19) v1(42.73,98.42) v1(42.8,29.34) v1(42.93,25.4) v1(42.9,15.47) v1(42.9,5.31) v1(43.31,83.44) v1(43.31,33.66) v1(43.6,107.19) v1(43.56,39.13) v1(43.56,27.56) v1(43.69,40.26) v1(44.07,77.72) v1(44.86,107.19) v1(44.96,41.53) v1(45.09,98.42) v1(45.34,30.73) v1(45.34,24.38) v1(45.83,107.19) v1(45.85,42.8) v1(45.85,36.83) v1(46.08,117.2) v1(46.08,112.12) v1(46.08,101.96) v1(46.08,96.88) v1(46.08,25.76) v1(46.86,43.43) v1(47.15,50.72) v1(47.55,83.44) v1(47.51,38.25) v1(47.54,36.7) v1(47.51,24.7) v1(47.88,43.69) v1(48,98.42) v1(47.98,20.55) v1(47.98,15.47) v1(47.98,10.39) v1(47.98,5.31) v1(49.4,51.18) v1(50.04,29.59) v1(50.29,78.61) v1(50.31,24.7) v1(50.8,39.65) v1(50.8,34.04) v1(50.8,32.77) v1(51.05,83.57) v1(51.16,117.2) v1(51.16,112.12) v1(51.16,107.04) v1(51.16,86.72) v1(51.16,25.76) v1(51.31,37.53) v1(51.31,36.45) v1(51.31,35.23) v1(51.31,31.24) v1(51.82,27.43) v1(52.83,43.94) v1(53.06,20.55) v1(53.06,15.47) v1(53.06,10.39) v1(53.06,5.31) v1(53.47,83.06) v1(53.86,36.82) v1(54.23,43.81) v1(54.48,71.5) v1(54.61,98.17) v1(54.61,73.79) v1(54.64,39.27) v1(54.74,69.34) v1(54.74,60.83) v1(54.86,67.31) v1(54.86,65.02) v1(54.86,58.55) v1(54.86,56.52) v1(54.86,52.07) v1(54.86,49.53) v1(54.86,47.23) v1(54.86,45.47) v1(54.99,62.86) v1(54.99,54.1) v1(55.37,44.07) v1(55.5,43.18) v1(56.13,33.91) v1(56.13,18.29) v1(56.24,117.2) v1(56.24,112.12) v1(56.24,107.04) v1(56.24,101.96) v1(56.24,96.88) v1(56.24,91.8) v1(56.24,86.72) v1(56.24,71.48) v1(56.24,66.4) v1(56.24,61.32) v1(56.24,56.24) v1(56.24,51.16) v1(56.24,46.08) v1(56.24,30.84) v1(56.24,25.76) v1(56.24,10.52) v1(56.26,32.64) v1(56.26,29.19) v1(56.26,27.43) v1(56.26,23.88) v1(56.26,21.06) v1(56.39,15.24) v1(56.39,12.97) v1(56.39,9.4) v1(56.39,7.49) v1(56.53,44.07) v1(56.48,43.18) v1(56.51,5.33) v1(56.51,3.21) v1(56.77,83.44) v1(56.77,35.43) v1(57.28,61.59) v1(57.4,37.47) v1(57.53,39.5) v1(57.49,36.3) v1(57.56,42.55) v1(57.66,76.07) v1(58.04,97.92) v1(58.29,38.61) v1(58.42,1.4) v1(58.67,41.43) v1(58.67,40.13) v1(58.93,94.23) v1(58.93,91.22) v1(58.93,87.76) v1(58.93,84.96) v1(58.93,42.95) v1(59.06,99.69) v1(59.18,96.52) v1(59.31,101.73) v1(59.8,61.59) v1(60.2,78.61) v1(60.32,43.18) v1(60.45,42.16) v1(60.45,37.97) v1(60.83,109.85) v1(61.32,117.2) v1(61.32,112.12) v1(61.32,101.96) v1(61.32,96.88) v1(61.32,91.8) v1(61.32,86.72) v1(61.32,76.56) v1(61.32,71.48) v1(61.32,66.4) v1(61.32,61.32) v1(61.32,56.24) v1(61.32,51.16) v1(61.32,46.08) v1(61.34,43.18) v1(61.32,30.84) v1(61.32,25.76) v1(61.32,20.68) v1(61.32,15.6) v1(61.32,10.52) v1(61.32,5.44) v1(61.67,109.85) v1(62.26,43.18) v1(62.41,61.59) v1(62.57,109.85) v1(62.87,80.9) v1(62.93,77.4) v1(62.99,69.98) v1(62.99,68.96) v1(62.99,67.82) v1(62.99,66.71) v1(62.99,65.27) v1(62.99,64.26) v1(63.07,38) v1(63.25,54.23) v1(63.25,52.96) v1(63.37,59.85) v1(63.37,58.67) v1(63.5,42.96) v1(63.67,48.26) v1(63.88,44.2) v1(64.44,75.75) v1(64.39,38.35) v1(64.39,37.59) v1(64.52,78.74) v1(64.52,70.87) v1(64.52,45.34) v1(65.02,61.59) v1(65.41,82.68) v1(65.38,73.57) v1(65.4,38.35) v1(65.6,45.34) v1(66.4,117.2) v1(66.4,112.12) v1(66.4,101.96) v1(66.4,81.64) v1(66.4,30.84) v1(66.4,25.76) v1(66.4,20.68) v1(66.4,15.6) v1(66.4,10.52) v1(66.4,5.44) v1(66.55,97.41) v1(66.55,96.44) v1(66.55,91.31) v1(66.68,107.19) v1(66.68,45.08) v1(67.31,33.91) v1(67.63,107.19) v1(68.2,87.63) v1(68.51,33.91) v1(68.62,107.19) v1(69.22,61.85) v1(69.6,43.31) v1(69.72,83.95) v1(69.72,35.31) v1(69.88,36.7) v1(70.74,62.61) v1(71.48,117.2) v1(71.48,112.12) v1(71.48,107.04) v1(71.48,101.96) v1(71.48,86.72) v1(71.5,85.72) v1(71.48,71.48) v1(71.48,66.4) v1(71.48,61.32) v1(71.48,56.24) v1(71.48,51.16) v1(71.48,46.08) v1(71.48,35.92) v1(71.48,30.84) v1(71.48,25.76) v1(71.48,20.68) v1(71.48,15.6) v1(71.48,10.52) v1(71.48,5.44) v1(72.14,63.37) v1(73.53,64.14) v1(74.17,78.87) v1(74.8,64.9) v1(75.43,78.87) v1(76.2,65.91) v1(76.33,85.72) v1(76.39,41.28) v1(76.47,77.46) v1(76.51,38.73) v1(76.56,117.2) v1(76.56,112.12) v1(76.56,107.04) v1(76.56,101.96) v1(76.56,91.8) v1(76.56,86.72) v1(76.56,81.64) v1(76.56,76.56) v1(76.56,71.48) v1(76.56,56.24) v1(76.56,46.08) v1(76.56,25.76) v1(76.56,20.68) v1(76.56,15.6) v1(76.56,10.52) v1(76.56,5.44) v1(77.34,41.28) v1(77.34,38.71) v1(77.47,66.8) v1(78.61,77.47) v1(78.99,67.82) v1(79.25,61.47) v1(79.25,56.17) v1(79.25,50.93) v1(79.25,29.72) v1(79.25,24.4) v1(79.25,19.18) v1(79.57,78.87) v1(80.39,85.34) v1(80.77,68.96) v1(80.89,78.87) v1(81.64,117.2) v1(81.64,112.12) v1(81.64,107.04) v1(81.64,101.96) v1(81.64,96.88) v1(81.64,91.8) v1(81.64,86.72) v1(81.64,81.64) v1(81.64,71.48) v1(81.64,66.4) v1(81.64,56.24) v1(81.64,46.08) v1(81.64,41) v1(81.64,35.92) v1(81.64,25.76) v1(81.64,20.68) v1(81.64,15.6) v1(81.64,10.52) v1(81.64,5.44) v1(81.95,77.4) v1(82.17,70.1) v1(83.19,83.31) v1(83.19,71.5) v1(83.44,80.75) v1(83.44,78.49) v1(83.44,73.12) v1(84.33,55.12) v1(84.46,85.72) v1(84.56,77.17) v1(84.58,33.15) v1(85.6,78.61) v1(86.72,117.2) v1(86.72,112.12) v1(86.72,107.04) v1(86.72,101.96) v1(86.72,96.88) v1(86.72,91.8) v1(86.72,86.72) v1(86.72,81.64) v1(86.72,71.48) v1(86.72,66.4) v1(86.72,61.32) v1(86.72,56.24) v1(86.72,35.92) v1(86.72,30.84) v1(86.72,15.6) v1(86.72,10.52) v1(86.72,5.44) v1(86.85,78.61) v1(86.88,42.67) v1(87.17,19.18) v1(87.5,85.98) v1(88.14,78.61) v1(88.65,19.18) v1(89.15,41.4) v1(89.35,78.61) v1(90.42,43.56) v1(90.58,78.61) v1(90.55,21.21) v1(91.45,85.98) v1(91.57,53.85) v1(91.57,52.67) v1(91.57,49.66) v1(91.58,48.59) v1(91.69,78.61) v1(91.69,72.52) v1(91.8,117.2) v1(91.8,112.12) v1(91.8,107.04) v1(91.8,101.96) v1(91.8,96.88) v1(91.8,91.8) v1(91.8,86.72) v1(91.8,81.64) v1(91.8,71.48) v1(91.8,66.4) v1(91.8,61.32) v1(91.8,56.24) v1(91.82,31.22) v1(91.82,30.19) v1(91.8,15.6) v1(91.8,10.52) v1(91.8,5.44) v1(92.07,27.31) v1(92.09,26.11) v1(92.71,77.22) v1(92.84,71.12) v1(93.94,71.12) v1(95,72.77) v1(95.88,85.72) v1(96.88,117.2) v1(96.88,112.12) v1(96.88,107.04) v1(96.88,101.96) v1(96.88,96.88) v1(96.88,91.8) v1(96.88,86.72) v1(96.88,81.64) v1(96.88,76.56) v1(96.9,66.29) v1(96.88,61.32) v1(96.88,56.24) v1(96.88,51.16) v1(96.88,41) v1(96.88,35.92) v1(96.88,15.6) v1(96.88,10.52) v1(96.88,5.44) v1(97.27,72.82) v1(97.28,71.12) v1(98.43,67.69) v1(99,31.75) v1(99,20.7) v1(99.06,53.21) v1(99.06,47.96) v1(99.06,42.55) v1(99.06,26.13) v1(99.69,85.98) v1(101.96,117.2) v1(101.96,112.12) v1(101.96,107.04) v1(101.96,101.96) v1(101.96,96.88) v1(101.96,91.8) v1(101.96,86.72) v1(101.96,81.64) v1(101.96,76.56) v1(101.96,71.48) v1(101.96,66.4) v1(101.96,61.32) v1(101.96,56.24) v1(101.96,41) v1(101.96,35.92) v1(101.96,25.76) v1(101.96,15.6) v1(101.96,10.52) v1(101.96,5.44) v1(102.87,73.53) v1(104.17,73.53) v1(104.27,53.47) v1(104.39,69.72) v1(104.39,44.07) v1(104.39,30.73) v1(104.52,21.21) v1(104.65,85.6) v1(104.9,48.89) v1(104.9,26.03) v1(105.16,72.64) v1(105.19,53.47) v1(105.41,71.12) v1(105.36,44.07) v1(105.43,30.73) v1(105.56,21.21) v1(106.68,44.07) v1(106.81,30.89) v1(106.93,53.47) v1(107.04,112.12) v1(107.04,107.04) v1(107.04,101.96) v1(107.04,96.88) v1(107.04,91.8) v1(107.04,86.72) v1(107.04,81.64) v1(107.04,76.56) v1(107.04,71.48) v1(107.04,66.4) v1(107.04,61.32) v1(107.04,56.24) v1(107.04,41) v1(107.04,35.92) v1(107.04,25.76) v1(107.04,20.68) v1(107.04,15.6) v1(107.04,10.52) v1(107.31,85.85) v1(109.85,85.98) v1(111.89,85.98) v1(112.12,112.12) v1(112.12,107.04) v1(112.12,101.96) v1(112.12,96.88) v1(112.12,91.8) v1(112.12,86.72) v1(112.12,81.64) v1(112.12,76.56) v1(112.12,71.48) v1(112.12,66.4) v1(112.12,61.32) v1(112.12,56.24) v1(112.12,51.16) v1(112.12,46.08) v1(112.12,41) v1(112.12,35.92) v1(112.12,30.84) v1(112.12,25.76) v1(112.12,20.68) v1(112.12,15.6) v1(112.12,10.52) v1(112.65,21.88) v2(43.31,32)
VIN: length 64.4
  Top Layer w1: 35.81,112.14 34.42,112.14 34.18,111.9 C80.1
  Top Layer w1.3: v3(35.31,78.49) 35.59,78.2 R65.2
  Top Layer w1.5: 18.71,106.05 18.38,105.71 ; 18.38,105.71 18.87,105.22 ; 18.38,105.71 D5.1 18.87,105.04 ; 18.87,105.22 19.09,105 ; 18.87,105.22 18.87,105.04 ; 18.87,105.22 18.87,105.67 ; 19.09,105 19.44,104.65 23.11,104.65 C85.1 ; 19.09,105 18.87,105.04 ; C80.1 32.56,111.06 31.76,111.06 31.05,110.35 31.05,109.55 28.73,107.24 25.7,107.24 ; 18.87,105.04 F1.2 19.94,103.3 D6.2
  Bottom Layer w1.5: C85.1 31.31,101.54 31.31,82.49 v3(35.31,78.49)
BCK: length 42.7
  Top Layer w0.254: v1(30.61,37.34) 33.27,37.34 39.29,31.32 45.8,31.32 48.26,33.78 48.26,41.78 48.64,42.16 53.85,42.16 54.76,41.25 U1.13 ; R62.1 27.05,37.85 v1(27.56,37.34)
  Bottom Layer w0.254: v1(30.61,37.34) v1(27.56,37.34)
BIN: length 42.3
  Top Layer w0.254: U1.14 54.78,40.6 53.85,41.53 50.29,41.53 49.02,40.26 49.02,30.99 48.01,29.97 38.99,29.97 32.77,36.19 30.35,36.19 29.59,36.96 R63.1
BUTTONS: length 95
  Top Layer w0.254: 32.27,12.06 32.31,12.03 R43.1 ; 32.27,12.06 30.35,12.06 29.65,11.36 v1(26.67,11.36) 25.27,11.36 ; 32.27,12.06 37.85,12.06 ; R41.1 R47.1 43.53,22.68 27.03,22.68 ; R44.1 37.82,12.03 37.85,12.06 ; 27.03,22.68 R38.1 24.56,22.61 24.26,22.61 24,22.86 v1(16.89,22.86) ; 27.03,22.68 27.05,22.66 v1(27.05,22.61) ; 37.85,12.06 44.07,12.06 ; 50.98,11.3 51.05,11.38 51.05,11.81 50.8,12.06 44.07,12.06 ; 44.07,12.06 44.32,11.81 44.32,11.38 R45.1
  Bottom Layer w0.254: v1(16.89,22.86) U16.21 ; v1(26.67,11.36) 26.67,15.1 CN8.1 27.05,18.71 v1(27.05,22.61)
DAC_OUT_L: length 25
  Top Layer w0.5: R2.2 74.22,38.72 C19.2 74.23,36.76 R34.1 ; R34.1 74.18,35.82 v1(74.17,35.81) ; R34.1 R16.1
  Bottom Layer w0.5: v1(74.17,35.81) 74.17,21.72 76.71,19.18 C110.1
DAC_OUT_R: length 26
  Top Layer w0.5: R11.1 R33.1 v1(74.05,44.2) ; R1.2 74.09,41.26 C18.1 74.18,41.35 74.18,43.31
  Bottom Layer w0.5: v1(74.05,44.2) 74.05,58.81 76.71,61.47 C106.1
DISP_BOOT_SCL: length 102.6
  Top Layer w0.254: R73.2 12.06,11.3 11.18,10.41 11.18,8.21 CN32.4 ; CN36.4 11.24,17.08 12.98,18.83 14.51,18.83 15.88,20.19 17.65,20.19 v1(18.03,20.57) ; v1(46.48,56.13) v1(20.57,56.13)
  Bottom Layer w0.254: CN29.2 45.97,71.23 45.97,65.66 46.48,65.15 v1(46.48,56.13) ; v1(20.57,56.13) 20.57,43.56 U16.22 18.03,41.02 v1(18.03,20.57) ; CN36.4 11.24,8.15 CN32.4
DISP_RST: length 33.1
  Top Layer w0.254: v1(35.43,59.94) v1(20.45,59.94)
  Bottom Layer w0.254: CN29.1 35.43,66.02 v1(35.43,59.94) ; v1(20.45,59.94) 19.43,58.93 U16.9
DISP_RX: length 7.3
  Bottom Layer w0.254: U16.2 37.21,60.79 CN22.1
DISP_TX: length 9.4
  Bottom Layer w0.254: CN22.3 45.17,62.95 42.42,60.2 40.64,60.2 39.75,59.31 U16.1
ENC1_A: length 49.8
  Top Layer w0.254: v1(29.59,52.83) 29.08,52.32 v1(9.14,52.32) ; CN30.4 4.95,33.33 R48.2
  Bottom Layer w0.254: v1(9.14,52.32) 8,51.18 8,36.01 CN30.4 ; v1(29.59,52.83) U16.5
ENC1_B: length 45
  Top Layer w0.254: v1(11.43,55.37) 26.92,55.37 v1(27.05,55.5) ; CN30.3 7.62,33.17 R49.2
  Bottom Layer w0.254: v1(11.43,55.37) 11.18,55.12 11.18,54.48 10.54,53.85 10.54,36.07 7.64,33.17 CN30.3 ; v1(27.05,55.5) U16.6
ENC2_A: length 47.6
  Top Layer w0.254: CN31.4 5.14,27.75 8.89,31.5 8.89,34.04 9.14,34.29 R54.2 9.73,36.52 10.16,36.96 10.16,37.97 11.05,38.86 12.7,38.86 v1(12.95,38.61) ; v1(24.51,53.72) 13.08,53.72 v1(12.95,53.59)
  Bottom Layer w0.254: v1(24.51,53.72) U16.7 ; v1(12.95,53.59) 12.99,53.55 12.99,38.65 v1(12.95,38.61)
ENC2_B: length 43
  Top Layer w0.254: v1(15.62,50.8) v1(22.1,50.8) ; CN31.3 7.64,26.94 11.43,30.73 R55.2 15.19,36.52 v1(15.62,36.96)
  Bottom Layer w0.254: v1(15.62,36.96) v1(15.62,50.8) ; U16.8 22.1,57.53 v1(22.1,50.8)
LRCK: length 49.7
  Top Layer w0.254: 56.06,39.95 54.67,39.95 53.72,40.89 50.93,40.89 50.04,40 50.04,30.42 47.11,27.49 CN33.4 46.09,28.4 38.28,28.4 31.37,35.31 25.65,35.31 24.51,36.45 R61.1
MIDI+: length 8.5
  Top Layer w0.5: CN6.3 8.03,88.55 8.51,89.03 11.92,89.03 L12.1
MIDI-: length 9.3
  Top Layer w0.5: CN6.1 8.27,83.55 9.02,82.8 9.98,82.8 D2.2 11.99,83.11 12.94,84.06 L13.1
MIDI-GND: length 4.5
  Top Layer w0.5: D2.1 10.29,84.88 9.94,85.22 10.28,85.55 R32.1 10.29,86.62 10.29,88.01
MIDI-SHLD: length 5.3
  Top Layer w0.5: C77.2 8.77,85.55 R32.2 8.21,86.05 CN6.2
MIDI_RX: length 73.4
  Top Layer w0.254: U16.12 11.81,59.44 12.32,59.94 17.02,59.94 17.78,60.71 v1(47.5,60.71) ; R29.1 35.31,84.19 39.88,79.63 v1(45.47,79.63)
  Top Layer w0.5: U15.6 32.79,85.09 R29.1
  Bottom Layer w0.254: v1(47.5,60.71) 47.5,75.44 45.47,77.47 v1(45.47,79.63)
MOT_1: length 19.8
  Top Layer w0.254: U12.3 31.4,64.8 30.99,64.39 30.99,63.88 29.72,62.61 v1(20.19,62.61)
  Bottom Layer w0.254: v1(20.19,62.61) 20.19,60.96 U16.10
MOT_2: length 21.8
  Top Layer w0.254: U12.2 30.13,64.17 29.46,63.5 v1(18.8,63.5)
  Bottom Layer w0.254: U16.11 14.35,58.29 15.24,59.18 16.51,59.18 18.8,61.47 v1(18.8,63.5)
POTI1: length 21.6
  Top Layer w0.254: v1(14.1,32) 19.89,32 R52.1 19.97,31.98 CN20.1
  Bottom Layer w0.254: v1(14.1,32) 14.1,35.69 12.32,37.47 12.32,41.91 U16.19
POTI2: length 26.6
  Top Layer w0.254: v1(15.24,33.78) 25.15,33.78 26.49,32.44 26.49,32.13 26.67,31.95 R53.1 31.84,31.95 CN21.1
  Bottom Layer w0.254: U16.20 14.35,36.7 15.24,35.81 v1(15.24,33.78)
SCK: length 46
  Top Layer w0.254: R60.1 21.97,38.35 v1(22.1,38.23) ; U1.12 55,41.9 53.92,42.98 47.55,42.98 46.61,42.04 46.61,35.18 44.32,32.89 39.12,32.89 34.49,37.52 34.48,37.52 34.14,37.86 34.14,37.87 33.78,38.23 v1(31.62,38.23)
  Bottom Layer w0.254: v1(31.62,38.23) v1(22.1,38.23)
SD_CS: length 18.6
  Top Layer w0.254: CARD1.2 16.29,70.53 R57.2 16.45,70.35 v1(16.45,69.79) ; v1(16.38,60.71) 16.31,60.63 R72.2
  Bottom Layer w0.254: v1(16.45,69.79) 16.51,69.72 16.51,60.83 v1(16.38,60.71)
SD_MISO: length 32.6
  Top Layer w0.254: R56.2 17.32,76.63 ; 17.32,76.63 R70.1 ; 17.32,76.63 17.35,76.63 v1(17.4,76.58) ; v1(17.53,62.1) 6.1,62.1 4.19,60.2 U16.15
  Bottom Layer w0.254: v1(17.53,62.1) 17.53,69.6 17.4,69.72 v1(17.4,76.58)
SD_MOSI: length 22.6
  Top Layer w0.254: v1(15.49,61.47) 7.57,61.47 R71.2 ; v1(13.84,71.63) 14.85,71.63 ; CARD1.3 16.46,71.63
  Bottom Layer w0.254: v1(15.49,61.47) 15.49,69.98 v1(13.84,71.63)
SD_SCK: length 44.1
  Top Layer w0.254: R69.1 2.54,38.86 v1(3.05,38.35) ; R59.2 16.13,74.17 15.79,73.83 CARD1.5 13.25,73.83 v1(12.95,73.53)
  Bottom Layer w0.254: v1(3.05,38.35) 5.46,40.77 5.46,50.17 10.54,55.25 10.54,60.71 12.95,63.12 v1(12.95,73.53)
SERVO1: length 93.7
  Top Layer w0.254: v1(46.61,44.96) 46.48,44.83 33.66,44.83 33.27,45.21 v1(9.27,45.21) ; U16.18 9.14,42.29 R67.1
  Bottom Layer w0.254: v1(46.61,44.96) 48.77,47.12 48.77,76.2 46.61,78.36 46.61,92.49 CN25.3 ; v1(9.27,45.21) U16.18
SERVO2_SDA: length 134
  Top Layer w0.254: v1(39.24,12.95) 13.84,12.95 ; 34.67,40.31 U16.28 36.45,44.2 47.37,44.2 v1(47.88,44.7)
  Bottom Layer w0.254: CN26.3 55.63,92.16 55.63,80.39 50.29,75.06 50.29,47.12 v1(47.88,44.7) ; U16.28 34.67,41.53 35.31,40.89 35.31,34.42 35.81,33.91 35.81,30.23 39.75,26.29 39.75,13.46 v1(39.24,12.95) ; CN36.3 v1(13.74,13.04) 13.74,8.15 CN32.3
VOUT+_L: length 11
  Top Layer w0.5: R15.2 93.22,17.78 94.11,18.67 94.11,22.58 U6.4 93.19,23.59 94.62,25.03 R22.1
VOUT+_R: length 10.7
  Top Layer w0.5: R10.2 93.6,40.51 94.62,41.53 94.62,44.29 U2.4 94.21,47.45 94.21,47.72 R8.1
VOUT-_L: length 13.3
  Top Layer w0.5: 93.09,30.62 U6.5 93.09,25.91 92.46,25.27 88.9,25.27 88.26,24.64 86.36,24.64 85.86,25.14 R74.1
VOUT-_R: length 14.7
  Top Layer w0.5: 85.61,47.62 85.61,46.47 85.95,46.13 87.66,46.13 88.01,46.48 88.01,47.12 88.65,47.75 92.46,47.75 92.84,48.13 U2.5 92.84,52.97 92.71,53.09
$1N1407: length 4.3
  Top Layer w0.35: C21.2 54.82,38.27 55.09,38 U1.18
  Top Layer w0.5: C7.2 53.01,39.61 C21.2
$1N1935: length 7.3
  Top Layer w0.35: C23.2 63.53,39.3 v1(63.06,39.3) U1.5
  Top Layer w0.5: v1(66.42,38.99) 66.86,38.55 C15.2
  Bottom Layer w0.5: v1(63.06,39.3) 66.11,39.3 v1(66.42,38.99)
$1N2008: length 5.2
  Top Layer w0.35: 59.94,36.83 60.2,37.08 60.45,37.08 60.71,37.34 61.79,37.34 U1.2
  Top Layer w0.8: 61.66,34.93 61.54,34.8 61.18,34.8 59.94,36.03 59.94,36.83
$1N2014: length 6.1
  Top Layer w0.35: U1.4 59.94,38.65
  Top Layer w0.8: 59.73,38.65 58.66,37.58 58.66,35.11 58.48,34.93
$1N2221: length 9.3
  Top Layer w0.35: R1.1 70.13,40.6 U1.7
$1N2225: length 9.8
  Top Layer w0.35: R2.1 70.8,39.23 70.08,39.95 61.8,39.95
$1N3304: length 3.8
  Top Layer w1: L10.1 67.25,51.88 L11.1
$1N3850: length 5
  Top Layer w0.8: 101.22,69.85 101.2,69.87 R3.1 100.19,71.84 C69.2 100.03,72 98.22,72
$1N4507: length 2
  Top Layer w0.6: U2.7 R5.1
$1N4717: length 5.8
  Top Layer w0.5: 87.11,49.15 R75.1 ; 86.99,49.02 86.99,51.17 87.53,51.72 88.52,51.72 U2.8
$1N5036: length 9.8
  Top Layer w0.5: R10.1 88.14,40.51 v1(88.01,40.39) ; v1(88.01,45.08) 87.89,44.97 87.89,44.94 ; 87.89,44.94 R9.2 ; 87.89,44.94 U2.1
  Bottom Layer w0.5: v1(88.01,40.39) v1(88.01,45.08)
$1N5767: length 2
  Top Layer w0.6: U6.7 R12.1
$1N5781: length 4.8
  Top Layer w0.5: R74.2 87.37,28.57 87.53,28.73 U6.8
$1N5788: length 10.3
  Top Layer w0.5: 88.26,22.57 87.77,22.08 R14.2 ; 88.26,22.57 U6.1 ; 88.26,22.57 88.26,22.6 v1(88.26,22.61) ; R15.1 v1(87.88,17.78)
  Bottom Layer w0.5: v1(88.26,22.61) 87.88,22.22 v1(87.88,17.78)
$1N6509: length 13.1
  Top Layer w0.5: 100.97,41.91 100.97,43.81 104.23,47.08 U7.1 109.29,47.08 CN4.3
$1N6548: length 11.6
  Top Layer w0.5: CN4.2 108.62,48.51 106.32,50.81 R20.2 103.12,50.81 100.84,53.09 C107.2
$1N7374: length 12.2
  Top Layer w0.5: CN5.3 110.18,24.1 U9.1 ; 106.93,24.22 106.58,23.87 R24.1 102.73,23.87 101.09,22.22 101.09,20.19
$1N7378: length 11.8
  Top Layer w0.5: CN5.2 108.24,26.42 U10.2 106.46,28.19 104.14,28.19 100.71,31.62 C113.2
$1N10090: length 4.2
  Top Layer w0.8: L2.2 80.11,75.18 C72.2
  Top Layer w1: L9.2 82.14,75.33 C72.2
$1N10332: length 4.1
  Top Layer w1: L10.2 67,57.67 L1.2
$1N13339: length 9.6
  Bottom Layer w0.5: C108.2 81.74,29.67 83.44,31.37 CN3.1
$1N13344: length 9.7
  Bottom Layer w0.5: C109.2 81.53,51.18 83.44,49.28 83.44,42.76
$1N19455: length 8.9
  Top Layer w0.5: 75.68,43.31 v1(75.68,44.07)
  Bottom Layer w0.5: C109.1 76.96,51.18 75.68,49.9 v1(75.68,44.07)
$1N19459: length 8.1
  Top Layer w0.5: R34.2 75.69,36.69 v1(75.69,35.94)
  Bottom Layer w0.5: C108.1 76.75,29.67 75.69,30.73 v1(75.69,35.94)
$1N19581: length 11.5
  Top Layer w0.5: 85.48,51.82 85.61,51.94 85.61,58.03 82.17,61.47 81.79,61.47
$1N24964: length 5.3
  Top Layer w0.5: 98.22,74.6 98.27,74.55 98.27,74.01 97.92,73.66 97.03,73.66 96.32,72.95 U3.1 96.27,71.94 R21.1
$1N33664: length 11
  Top Layer w0.5: 85.86,27.43 85.47,27.43 84.2,26.16 84.2,21.59 81.79,19.18 C110.2
$1N33672: length 5.6
  Top Layer w0.5: 96.52,42.55 96.52,45.85 95.88,46.49 R8.2
$1N33674: length 4.2
  Top Layer w0.5: 96.46,53.21 95.07,54.6 R18.2
$1N33676: length 6.2
  Top Layer w0.5: 96.9,20.32 96.9,25.39 R22.2
$1N33681: length 3.6
  Top Layer w0.5: 96.46,31.75 96.46,31.81 96.15,32.12 93.09,32.12
$2N918: length 5.4
  Top Layer w1.3: 61.75,103.76 63.01,103.76 L7.2 ; 61.75,103.76 L6.1 ; 61.75,103.76 61.75,106.16 C63.1
$2N4325: length 1.4
  Top Layer w0.5: C81.2 37.14,115.72 U17.1
$2N4366: length 13.6
  Top Layer w0.254: U17.6 37.3,111.98
  Top Layer w0.508: C81.1 v1(37.21,117.35)
  Top Layer w1.25: D4.1 39.54,112.14 37.59,112.14
  Top Layer w2: 37.85,111.38 38.48,110.74 L14.1 39.88,111.46 D4.1
  Bottom Layer w0.254: v1(37.21,117.35) 37.21,112.4 v1(37.72,111.89)
$2N4745: length 2.9
  Top Layer w0.254: U17.3 v1(35.25,115.44) 35.25,115.83 35.05,116.03 ; R36.2 R37.1
$2N5209: length 13.4
  Top Layer w1.5: F1.1 15.04,102.36 CN7.1 CN7.1
$3N1707: length 4.8
  Top Layer w0.5: 23.07,87.75 22.94,87.88 18.33,87.88
$3N1715: length 9.1
  Top Layer w0.5: 14.34,84.83 19.51,84.83 D1.2 22.84,85.44 23.07,85.21
$3N1862: length 2.4
  Top Layer w0.5: L12.2 R31.1
$4N1617: length 9
  Top Layer w0.254: R47.2 43.58,23.5 v1(42.54,23.5)
  Bottom Layer w0.254: CN11.1 42.54,19.07 v1(42.54,23.5)
$4N1679: length 8.5
  Top Layer w0.254: R41.2 50.27,23.37 v1(49.4,23.37)
  Bottom Layer w0.254: v1(49.4,23.37) 49.4,18.82 CN12.1
$4N1741: length 7.1
  Top Layer w0.254: v1(23.62,11.3) 24.35,11.3 R42.2
  Bottom Layer w0.254: CN13.1 23.62,6.85 v1(23.62,11.3)
$4N1803: length 7.1
  Top Layer w0.254: R43.2 31,10.92 v1(30.35,10.92)
  Bottom Layer w0.254: v1(30.35,10.92) 30.35,6.77 CN14.1
$4N1865: length 7.7
  Top Layer w0.254: v1(35.94,10.79) 35.94,11.18 36.12,11.36 36.95,11.36 36.95,11.36
  Bottom Layer w0.254: CN15.1 35.94,7.84 v1(35.94,10.79)
$4N1927: length 7.5
  Top Layer w0.254: v1(42.42,10.92) 42.8,11.3 R45.2
  Bottom Layer w0.254: CN16.1 42.42,8.01 v1(42.42,10.92)
$4N1989: length 6.9
  Top Layer w0.254: v1(49.4,10.54) 49.4,10.59 R46.2
  Bottom Layer w0.254: CN17.1 49.4,7.68 v1(49.4,10.54)
$4N2006: length 8.7
  Top Layer w0.254: R40.2 36.93,23.5 v1(36.07,23.5)
  Bottom Layer w0.254: v1(36.07,23.5) 36.07,18.82 CN10.1
$4N2009: length 8.2
  Top Layer w0.254: v1(29.97,23.37) 30.78,23.37 R39.2
  Bottom Layer w0.254: CN9.1 29.97,18.46 v1(29.97,23.37)
$4N2912: length 2.2
  Top Layer w0.254: U16.25 R62.2
$4N2931: length 2.2
  Top Layer w0.254: U16.23 R60.2
$4N2944: length 2.2
  Top Layer w0.254: U16.26 R63.2
$4N2957: length 2.2
  Top Layer w0.254: U16.24 R61.2
$4N2969: length 3
  Top Layer w0.254: U16.16 4.19,41.71 R69.2
$4N2975: length 2.1
  Top Layer w0.254: R71.1 U16.14
$4N2978: length 2.1
  Top Layer w0.254: R72.1 U16.13
$4N3425: length 1.6
  Top Layer w0.254: R70.2 16.38,76.03 CARD1.7
$4N4375: length 3.4
  Top Layer w0.8: U12.8 28.86,75.28
$4N4376: length 3.5
  Top Layer w0.8: U12.6 31.4,75.41
$4N4381: length 1.8
  Top Layer w0.254: U12.4 32.67,64.15 R64.2
$4N4382: length 8.3
  Top Layer w1: 36.28,75.14 R66.1 ; 36.28,75.14 33.27,72.14 ; 36.28,75.14 R65.1 ; C37.1 34.13,71.91 U12.5
$4N7943: length 6.5
  Top Layer w1.5: 39.75,36.11 40.02,36.38 40.02,38.48 39.75,38.75 U16.30

## Copper pours and planes (outline as drawn; the poured copper is in the pictures)
3V3 on Inner2: 0,0 56.19,0 56.19,34.87 56.01,35.05 57.66,36.7 57.66,43.05 57.53,43.18 53.74,43.18 53.49,43.43 53.49,62.12 53.59,62.23 67.82,62.23 67.94,62.36 67.94,75.82 60.32,83.44 43.31,83.44 40.12,86.62 30.72,86.62 30.72,80.63 30.48,80.39 0,80.39
GND on Top Layer: -0.51,120.4 113.79,120.4 113.79,0.38 -0.51,0.38
GND on Bottom Layer: 0,120.02 114.3,120.02 114.3,0 0,0
GND on Inner1: -0.51,120.14 113.79,120.14 113.79,0.13 -0.51,0.13

## Text on the board
Top Silkscreen Layer: A | B | 5V | GND | RX | TX | SIG | R | L | SCL | 3V3 | RST | BOOT | DATA | LRCK | SCK | BCK | GND / - / + | SDA | LINE OUT | - | + | MAX 28VDC | POT1 | BTN6 | BTN1 | POT2 | BTN7 | BTN2 | BTN8 | BTN3 | PWM | BTN9 | BTN4 | DISP_CTRL | DISP_IO | BTN5 | BTN10 | PWR | ENC1 | ENC2 | I2C | MOT | VIN | SRV1 | I2S | SRV2 | XLR R | XLR L | MIDI IN | PWRIN | StageAudioController-S3 | 20260921 | ESP32-S3 Nano / F16M8
